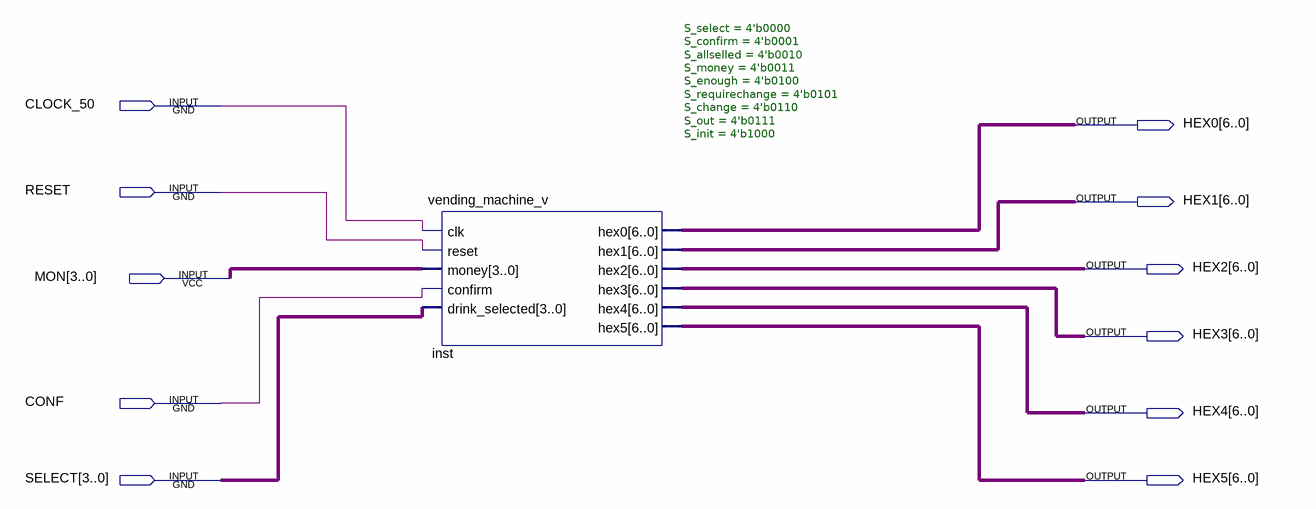
[diagram p0: schematic sheet]
// Quartus schematic vending_machine.bdf as structural Verilog: 1 symbols, 11 pins
module vending_machine (
  input  CLOCK_50,
  input  RESET,
  input  [3:0] MON,
  input  CONF,
  input  [3:0] SELECT,
  output [6:0] HEX0,
  output [6:0] HEX1,
  output [6:0] HEX2,
  output [6:0] HEX3,
  output [6:0] HEX4,
  output [6:0] HEX5
);

  vending_machine_v #(.S_select(4'b0000), .S_confirm(4'b0001), .S_allselled(4'b0010), .S_money(4'b0011), .S_enough(4'b0100), .S_requirechange(4'b0101), .S_change(4'b0110), .S_out(4'b0111), .S_init(4'b1000)) inst (
    .clk(CLOCK_50), .reset(RESET), .money(MON), .confirm(CONF), .drink_selected(SELECT), .hex0(HEX0),
    .hex1(HEX1), .hex2(HEX2), .hex3(HEX3), .hex4(HEX4), .hex5(HEX5));
endmodule
